# Altium schematic sheet 主控.SchDoc: 电源
size A4; DocumentNumber: 4; Revision: 樊浩柏; SheetNumber: 4; SheetTotal: 6
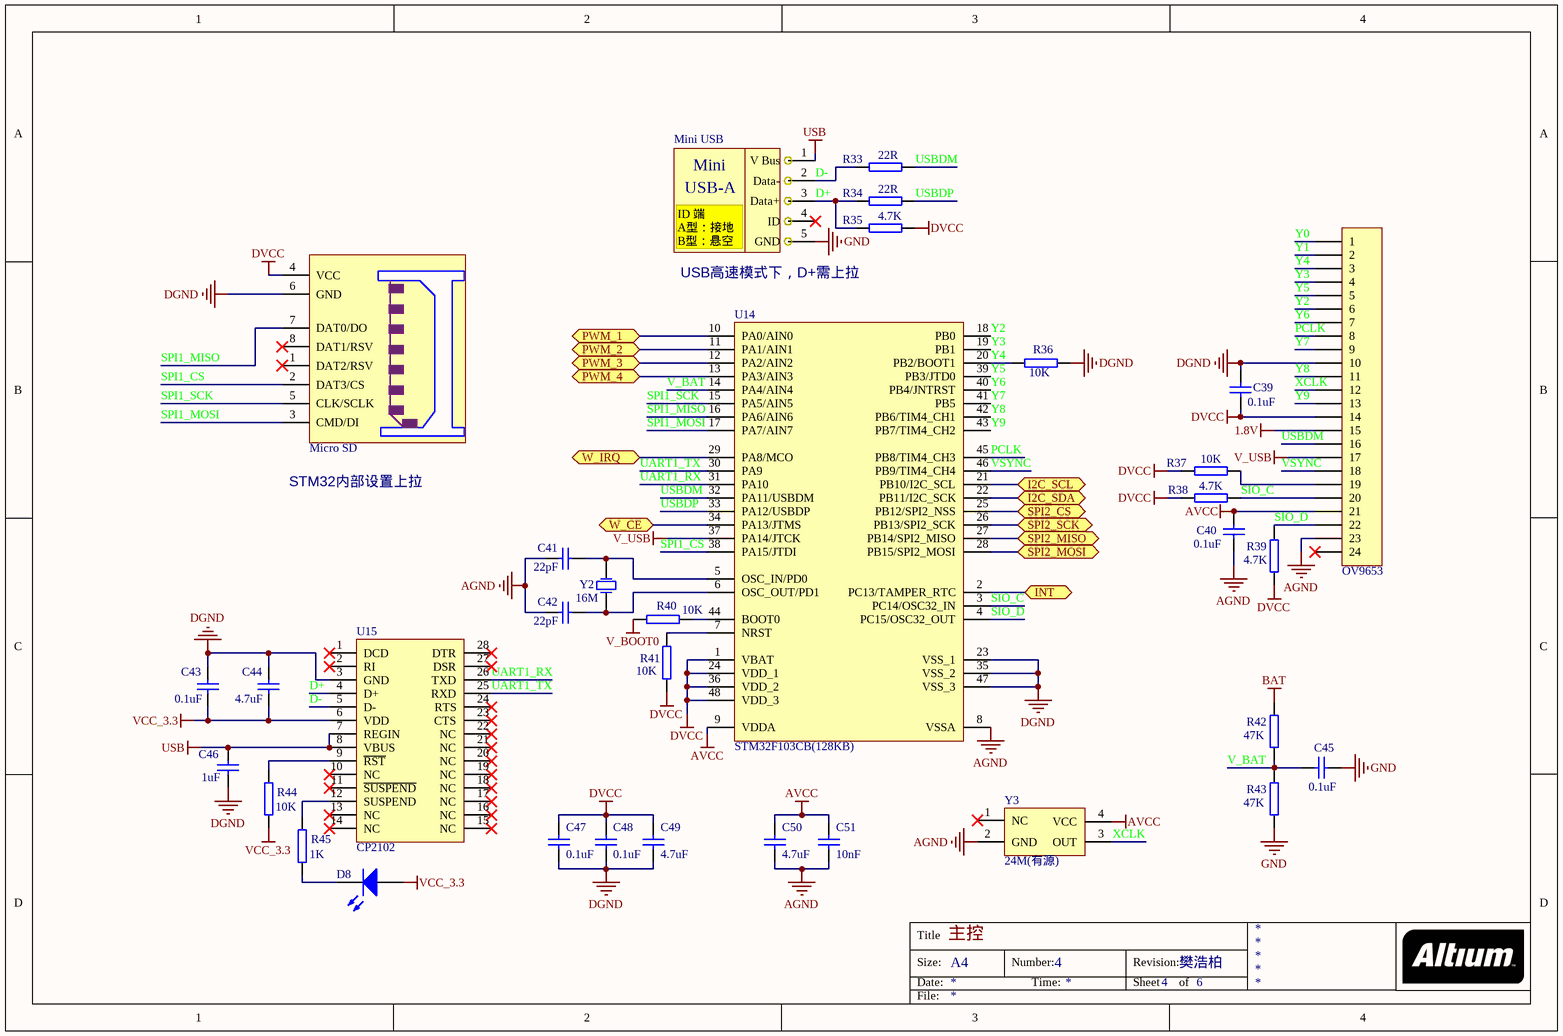
[diagram p0: 主控.SchDoc]

## Parts
C39  0.1uF  [CAP-0402]
C40  0.1uF  [CAP-0402]
C41  22pF  [CAP-0402]
C42  22pF  [CAP-0402]
C43  0.1uF  [CAP-0402]
C44  4.7uF  [CAP-0402]
C45  0.1uF  [CAP-0402]
C46  1uF  [CAP-0402]
C47  0.1uF  [CAP-0402]
C48  0.1uF  [CAP-0402]
C49  4.7uF  [CAP-0402]
C50  4.7uF  [CAP-0402]
C51  10nF  [CAP-0402]
D8  LED  [LED-GRE-0603]  (value not drawn)
Micro_SD  SD  [Micro-SD]  (value not drawn)
Mini_USB  Mini-USB-A  [Mini-USB(a)-SMD]  (value not drawn)
OV9653  CON-24X1  [HEADER-FPC-ZIF-SMD-Horizontal-0.5-24]  (value not drawn)
R33  22R  [RES-0402]
R34  22R  [RES-0402]
R35  4.7K  [RES-0402]
R36  10K  [RES-0402]
R37  10K  [RES-0402]
R38  4.7K  [RES-0402]
R39  4.7K  [RES-0402]
R40  10K  [RES-0402]
R41  10K  [RES-0402]
R42  47K  [RES-0402]
R43  47K  [RES-0402]
R44  10K  [RES-0402]
R45  1K  [RES-0402]
U14  STM32F103CB(128KB)  [QFN-48-7x7mm]
U15  CP2102  [QFN-28-5x5mm]
Y2  16M  [XTAL-OSC-3225]
Y3  24M(有源)  [XTAL-OSC-3225]

## Ports
I2C_SCL, I2C_SDA, INT, PWM_1, PWM_2, PWM_3, PWM_4, SPI2_CS, SPI2_MISO, SPI2_MOSI, SPI2_SCK, W_CE, W_IRQ

## Nets
1.8V: OV9653.15
AGND: C40.2 C41.2 C42.2 C50.2 C51.2 OV9653.23 U14.8(VSSA) Y3.2(GND)
AVCC: C40.1 C50.1 C51.1 OV9653.21 U14.9(VDDA) Y3.4(VCC)
BAT: R42.1
DGND: C39.1 C43.2 C44.2 C46.1 C47.2 C48.2 C49.2 Micro_SD.6(GND) OV9653.10 R36.1 U14.23(VSS_1) U14.35(VSS_2) U14.47(VSS_3) U15.3(GND)
DVCC: C39.2 C47.1 C48.1 C49.1 Micro_SD.4(VCC) OV9653.14 R35.2 R37.2 R38.2 R39.2 R41.1 U14.1(VBAT) U14.24(VDD_1) U14.36(VDD_2) U14.48(VDD_3)
GND: C45.2 Mini_USB.5(GND) R43.2
USB: C46.2 Mini_USB.1(V_Bus) U15.7(REGIN) U15.8(VBUS)
V_BOOT0: R40.1
V_USB: OV9653.17 U14.37(PA14/JTCK)
VCC_3.3: C43.1 C44.1 D8.A R44.2 U15.6(VDD)
D+: Mini_USB.3(Data+) R34.1 R35.1 U15.4(D+)
D-: Mini_USB.2(Data-) R33.1 U15.5(D-)
I2C_SCL: U14.21(PB10/I2C_SCL) ; port I2C_SCL
I2C_SDA: U14.22(PB11/I2C_SCK) ; port I2C_SDA
INT: U14.2(PC13/TAMPER_RTC) ; port INT
PCLK: OV9653.8 U14.45(PB8/TIM4_CH3)
PWM_1: U14.10(PA0/AIN0) ; port PWM_1
PWM_2: U14.11(PA1/AIN1) ; port PWM_2
PWM_3: U14.12(PA2/AIN2) ; port PWM_3
PWM_4: U14.13(PA3/AIN3) ; port PWM_4
SIO_C: OV9653.20 R38.1 U14.3(PC14/OSC32_IN)
SIO_D: OV9653.22 R39.1 U14.4(PC15/OSC32_OUT)
SPI1_CS: Micro_SD.2(DAT3/CS) U14.38(PA15/JTDI)
SPI1_MISO: Micro_SD.7(DAT0/DO) U14.16(PA6/AIN6)
SPI1_MOSI: Micro_SD.3(CMD/DI) U14.17(PA7/AIN7)
SPI1_SCK: Micro_SD.5(CLK/SCLK) U14.15(PA5/AIN5)
SPI2_CS: U14.25(PB12/SPI2_NSS) ; port SPI2_CS
SPI2_MISO: U14.27(PB14/SPI2_MISO) ; port SPI2_MISO
SPI2_MOSI: U14.28(PB15/SPI2_MOSI) ; port SPI2_MOSI
SPI2_SCK: U14.26(PB13/SPI2_SCK) ; port SPI2_SCK
UART1_RX: U14.31(PA10) U15.26(TXD)
UART1_TX: U14.30(PA9) U15.25(RXD)
USBDM: OV9653.16 R33.2 U14.32(PA11/USBDM)
USBDP: R34.2 U14.33(PA12/USBDP)
V_BAT: C45.1 R42.2 R43.1 U14.14(PA4/AIN4)
VSYNC: OV9653.18 U14.46(PB9/TIM4_CH4)
W_CE: U14.34(PA13/JTMS) ; port W_CE
W_IRQ: U14.29(PA8/MCO) ; port W_IRQ
XCLK: OV9653.12 Y3.3(OUT)
Y0: OV9653.1
Y1: OV9653.2
Y2: OV9653.6 U14.18(PB0)
Y3: OV9653.4 U14.19(PB1)
Y4: OV9653.3 R36.2 U14.20(PB2/BOOT1)
Y5: OV9653.5 U14.39(PB3/JTD0)
Y6: OV9653.7 U14.40(PB4/JNTRST)
Y7: OV9653.9 U14.41(PB5)
Y8: OV9653.11 U14.42(PB6/TIM4_CH1)
Y9: OV9653.13 U14.43(PB7/TIM4_CH2)
NetC41_1: C41.1 U14.5(OSC_IN/PD0) Y2.3(OSC2)
NetC42_1: C42.1 U14.6(OSC_OUT/PD1) Y2.1(OSC1)
NetD8_K: D8.K R45.2
NetOV9653_19: OV9653.19 R37.1
NetR40_2: R40.2 U14.44(BOOT0)
NetR41_2: R41.2 U14.7(NRST)
NetR44_1: R44.1 U15.9(~{RST})
NetR45_1: R45.1 U15.12(SUSPEND)

Not connected (* = marked no-connect by the designer): Micro_SD 1(DAT2/RSV)* 8(DAT1/RSV)*; Mini_USB 4(ID)*; OV9653 24*; U15 1(DCD)* 2(RI)* 10(NC)* 11(~{SUSPEND})* 13(NC)* 14(NC)* 15(NC)* 16(NC)* 17(NC)* 18(NC)* 19(NC)* 20(NC)* 21(NC)* 22(NC)* 23(CTS)* 24(RTS)* 27(DSR)* 28(DTR)*; Y3 1(NC)*

## Notes on the sheet
- (near Mini_USB) USB高速模式下，D+需上拉
- (near Micro_SD) STM32内部设置上拉
- Title
- Size:
- Date:
- 主控
- A4
- Number:
- Time:
- Revision:
- Sheet
- of
- File:
- (in symbol Mini-USB-A) Mini; USB-A; ID 端 / A型：接地 / B型：悬空

## Library data of the parts
C39-C51 = Cap
Micro_SD = Micro-SD
R33-R45 = Res
U14 = STM32F103-48P
Y2 = XTAL
Y3 = XTAL-OSC